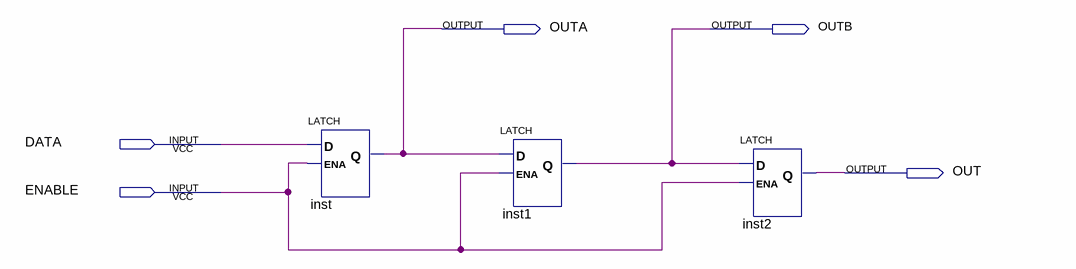
[diagram p0: schematic sheet]
// Quartus schematic ex1latch.bdf as structural Verilog: 3 symbols, 5 pins
module ex1latch (
  input  DATA,
  input  ENABLE,
  output OUTA,
  output OUTB,
  output OUT
);

  LATCH inst (.D(DATA), .ENA(ENABLE), .Q(OUTA));
  LATCH inst1 (.D(OUTA), .ENA(ENABLE), .Q(OUTB));
  LATCH inst2 (.D(OUTB), .ENA(ENABLE), .Q(OUT));
endmodule
